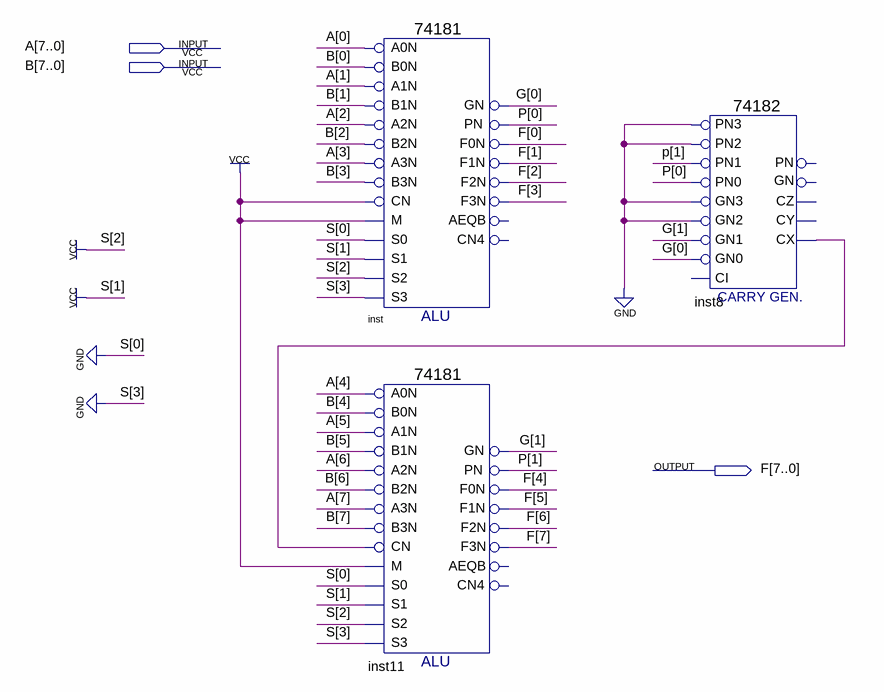
[diagram p0: schematic sheet]
// Quartus schematic logic_A⊕B.bdf as structural Verilog: 3 symbols, 3 pins
module \logic_A⊕B  (
  input  [7:0] A,
  input  [7:0] B,
  output [7:0] F
);

  wire inst8_cx;
  wire [1:0] G, P;

  \74181  inst (
    .B0N(B[0]), .A0N(A[0]), .A1N(A[1]), .B1N(B[1]), .A3N(A[3]), .B2N(B[2]), .A2N(A[2]), .M(1'b1), .CN(1'b1),
    .B3N(B[3]), .S2(1'b1), .S1(1'b1), .S0(1'b0), .S3(1'b0), .PN(P[0]), .GN(G[0]), .F3N(F[3]), .F1N(F[1]),
    .F0N(F[0]), .F2N(F[2]));  // open: AEQB, CN4
  \74181  inst11 (
    .B0N(B[4]), .A0N(A[4]), .A1N(A[5]), .B1N(B[5]), .A3N(A[7]), .B2N(B[6]), .A2N(A[6]), .M(1'b1),
    .CN(inst8_cx), .B3N(B[7]), .S2(1'b1), .S1(1'b1), .S0(1'b0), .S3(1'b0), .PN(P[1]), .GN(G[1]), .F3N(F[7]),
    .F1N(F[5]), .F0N(F[4]), .F2N(F[6]));  // open: AEQB, CN4
  \74182  inst8 (
    .PN2(1'b0), .GN2(1'b0), .GN3(1'b0), .PN3(1'b0), .PN1(P[1]), .PN0(P[0]), .GN1(G[1]), .GN0(G[0]),
    .CX(inst8_cx));  // open: CI, CY, PN, CZ, GN
endmodule
